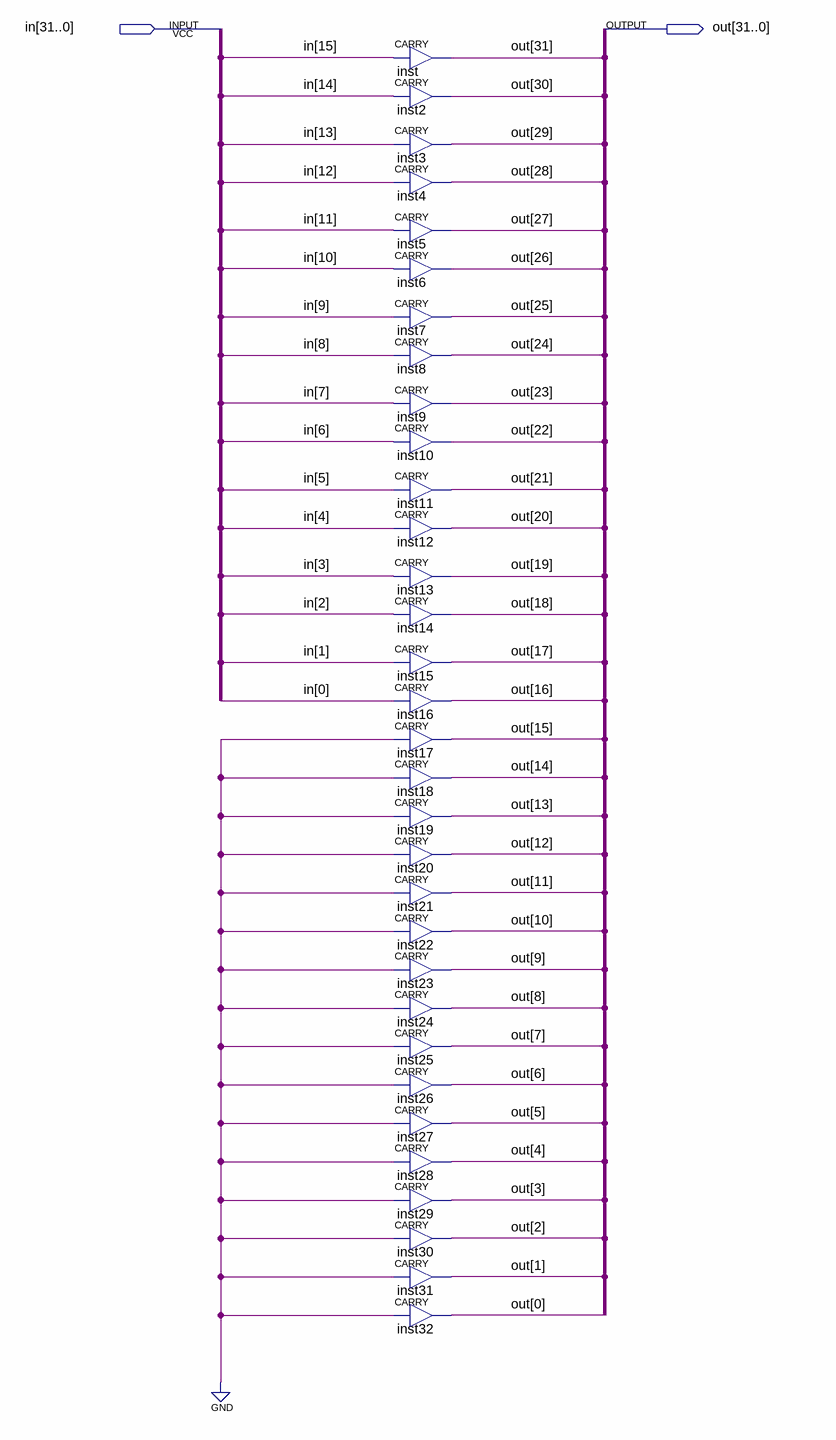
[diagram p0: schematic sheet]
// Quartus schematic lui.bdf as structural Verilog: 32 symbols, 2 pins
module lui (
  input  [31:0] in,
  output [31:0] out
);

  CARRY inst (.IN(in[15]), .OUT(out[31]));
  CARRY inst2 (.IN(in[14]), .OUT(out[30]));
  CARRY inst3 (.IN(in[13]), .OUT(out[29]));
  CARRY inst4 (.IN(in[12]), .OUT(out[28]));
  CARRY inst5 (.IN(in[11]), .OUT(out[27]));
  CARRY inst6 (.IN(in[10]), .OUT(out[26]));
  CARRY inst7 (.IN(in[9]), .OUT(out[25]));
  CARRY inst8 (.IN(in[8]), .OUT(out[24]));
  CARRY inst9 (.IN(in[7]), .OUT(out[23]));
  CARRY inst10 (.IN(in[6]), .OUT(out[22]));
  CARRY inst11 (.IN(in[5]), .OUT(out[21]));
  CARRY inst12 (.IN(in[4]), .OUT(out[20]));
  CARRY inst13 (.IN(in[3]), .OUT(out[19]));
  CARRY inst14 (.IN(in[2]), .OUT(out[18]));
  CARRY inst15 (.IN(in[1]), .OUT(out[17]));
  CARRY inst16 (.IN(in[0]), .OUT(out[16]));
  CARRY inst17 (.IN(1'b0), .OUT(out[15]));
  CARRY inst18 (.IN(1'b0), .OUT(out[14]));
  CARRY inst19 (.IN(1'b0), .OUT(out[13]));
  CARRY inst20 (.IN(1'b0), .OUT(out[12]));
  CARRY inst21 (.IN(1'b0), .OUT(out[11]));
  CARRY inst22 (.IN(1'b0), .OUT(out[10]));
  CARRY inst23 (.IN(1'b0), .OUT(out[9]));
  CARRY inst24 (.IN(1'b0), .OUT(out[8]));
  CARRY inst25 (.IN(1'b0), .OUT(out[7]));
  CARRY inst26 (.IN(1'b0), .OUT(out[6]));
  CARRY inst27 (.IN(1'b0), .OUT(out[5]));
  CARRY inst28 (.IN(1'b0), .OUT(out[4]));
  CARRY inst29 (.IN(1'b0), .OUT(out[3]));
  CARRY inst30 (.IN(1'b0), .OUT(out[2]));
  CARRY inst31 (.IN(1'b0), .OUT(out[1]));
  CARRY inst32 (.IN(1'b0), .OUT(out[0]));
endmodule
